# Altium schematic sheet Convertisseur_SPI_UART.SchDoc
size 203 x 152 mm
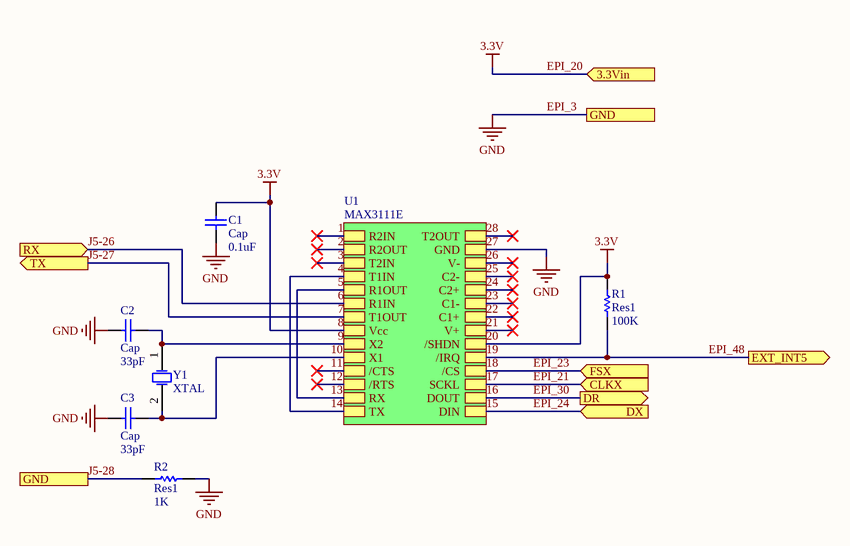
[diagram p0: Convertisseur_SPI_UART.SchDoc]

## Parts
C1  Cap  value 0.1uF  [RAD-0.3]
C2  Cap  value 33pF  [RAD-0.3]
C3  Cap  value 33pF  [RAD-0.3]
R1  Res1  value 100K  [AXIAL-0.3]
R2  Res1  value 1K  [AXIAL-0.3]
Y1  XTAL  [R38]

## Sub-sheets
U1 = MAX3111E: R2IN, R2OUT, T2IN, T1IN, R1OUT, R1IN, T1OUT, Vcc, X2, X1, /CTS, /RTS, RX, TX, T2OUT, GND, V-, C2-, C2+, C1-, C1+, V+, /SHDN, /IRQ, /CS, SCKL, DOUT, DIN

## Ports
3.3Vin (in), CLKX (in), DR (out), DX (in), EXT_INT5 (out), FSX (in), GND, RX (in), TX (out)

## Nets
20: C1.2 R1.1 ; port 3.3Vin, sheet U1/Vcc, sheet U1//SHDN  [also labelled 3.3V, 8, EPI_20]
27: C1.1 C2.1 C3.1 R2.1 R2.2 ; port GND, sheet U1/GND  [also labelled EPI_3, GND, J5-28]
1: sheet U1/R2IN
2: sheet U1/R2OUT
3: sheet U1/T2IN
6: port RX, sheet U1/R1IN  [also labelled J5-26]
7: port TX, sheet U1/T1OUT  [also labelled J5-27]
9: C2.2 Y1.1(OSC1) ; sheet U1/X2
10: C3.2 Y1.2(OSC2) ; sheet U1/X1
11: sheet U1//CTS
12: sheet U1//RTS
13: sheet U1/R1OUT, sheet U1/RX  [also labelled 5]
14: sheet U1/T1IN, sheet U1/TX  [also labelled 4]
15: port DX, sheet U1/DIN  [also labelled EPI_24]
16: port DR, sheet U1/DOUT  [also labelled EPI_30]
17: port CLKX, sheet U1/SCKL  [also labelled EPI_21]
18: port FSX, sheet U1//CS  [also labelled EPI_23]
19: R1.2 ; port EXT_INT5, sheet U1//IRQ  [also labelled EPI_48]
21: sheet U1/V+
22: sheet U1/C1+
23: sheet U1/C1-
24: sheet U1/C2+
25: sheet U1/C2-
26: sheet U1/V-
28: sheet U1/T2OUT

## Library data of the parts
C1-C3 = Cap: Capacitor; Published: 8-Jun-2000; LatestRevisionDate: 17-Jul-2002; LatestRevisionNote: Re-released for DXP Platform.; PackageReference: RAD-0.3; Publisher: Altium Limited; PackageDescription: Radial Cap, Thru-Hole; 2 Leads; 0.3 in Pin Spacing
R1 R2 = Res1: Resistor; Published: 8-Jun-2000; LatestRevisionDate: 17-Jul-2002; LatestRevisionNote: Re-released for DXP Platform.; PackageReference: AXIAL-0.3; Publisher: Altium Limited; PackageDescription: Axial Device, Thru-Hole; 2 Leads; 0.3 in Pin Spacing
Y1 = XTAL: Crystal Oscillator; Published: 8-Jun-2000; LatestRevisionDate: 17-Jul-2002; LatestRevisionNote: Re-released for DXP Platform.; PackageReference: R38; Publisher: Altium Limited; PackageDescription: Crystal, Thru-Hole; 2 Leads; Body 3.1 x 8.2 mm (Dia.xH)